# EAGLE design AC Motor Control Shield (EAGLE 6.4)
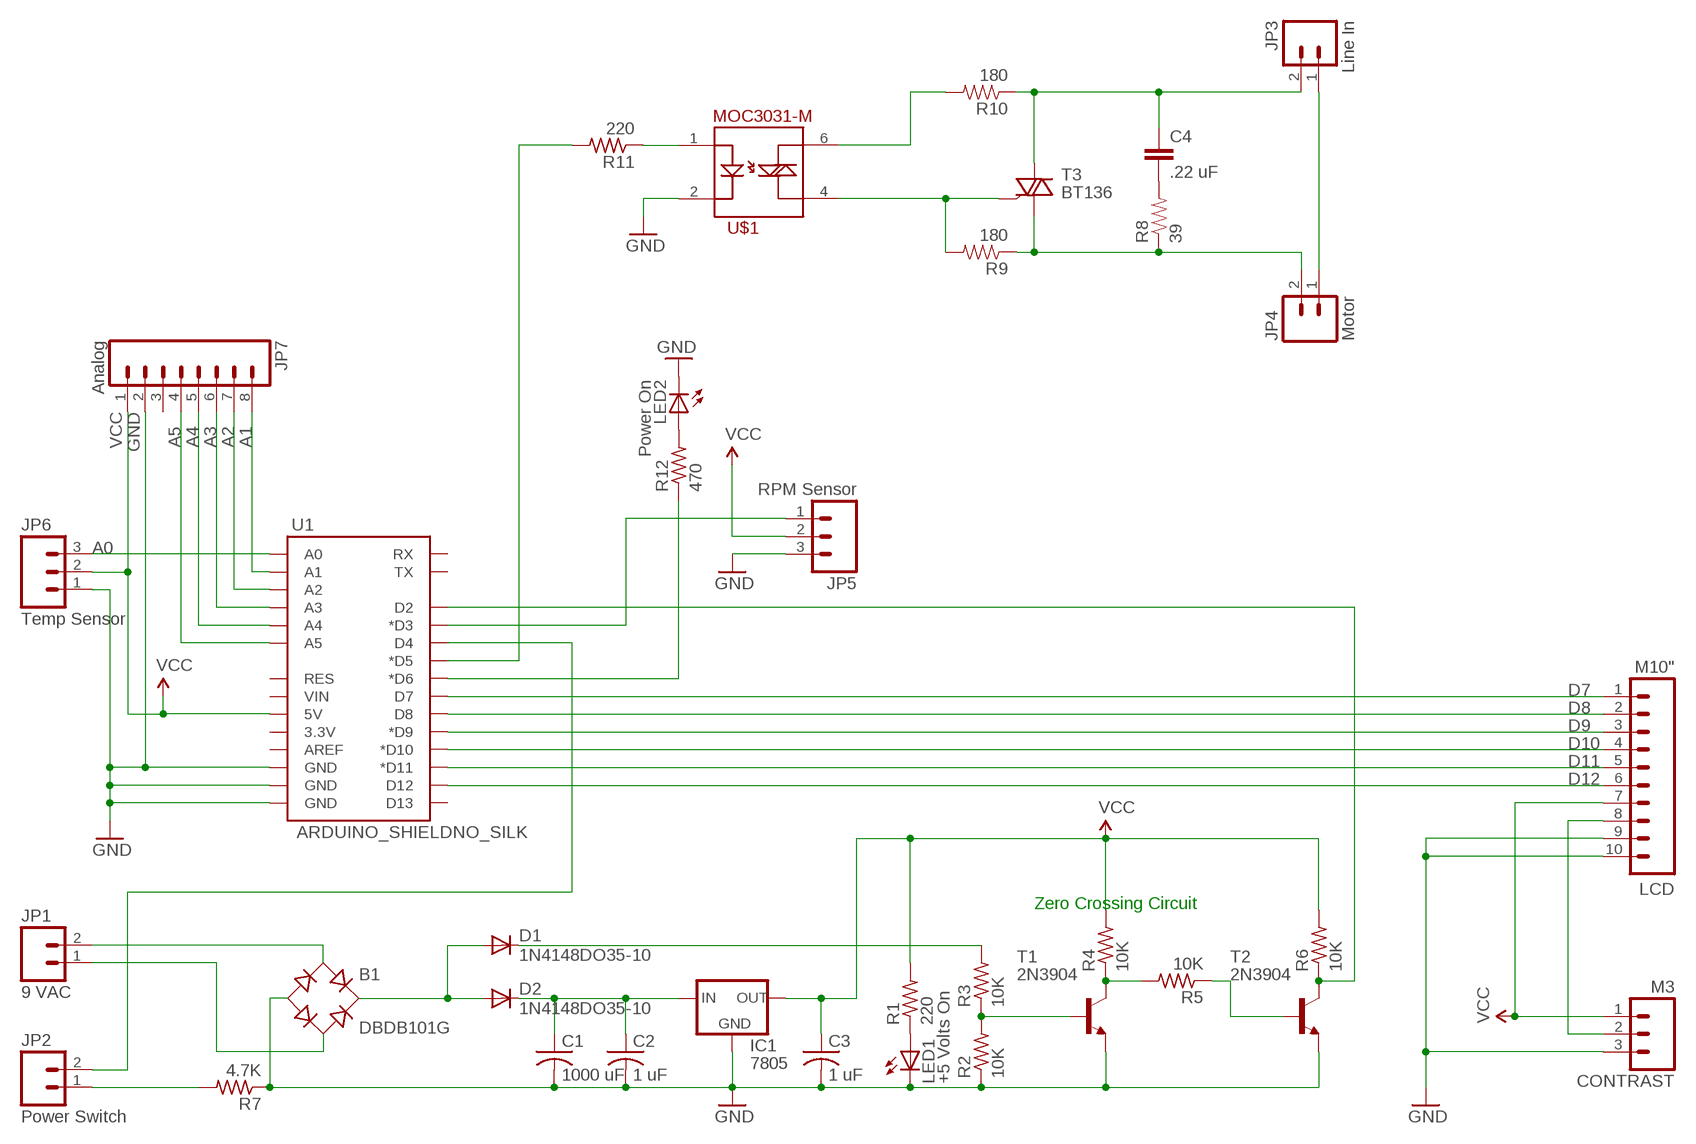
[diagram p0: schematic, sheet 1]

## Parts
B1  DBDB101G  [DB]
C1  1000 uF  C-US050-035X075  [C050-035X075]
C2  1 uF  C-US050-035X075  [C050-035X075]
C3  1 uF  C-US050-035X075  [C050-035X075]
C4  .22 uF  CAPPTH3  [CAP-PTH-LARGE]
CONTRAST  M3  M03PTH  [1X03]
D1  1N4148DO35-10  [DO35-10]
D2  1N4148DO35-10  [DO35-10]
IC1  7805  V_REG_78XX-TO-220  [TO-220-ALT]
JP1  9 VAC  M025MM  [SCREWTERMINAL-5MM-2]
JP2  Power Switch  M02PTH  [1X02]
JP3  Line In  M025MM  [SCREWTERMINAL-5MM-2]
JP4  Motor  M025MM  [SCREWTERMINAL-5MM-2]
JP5  RPM Sensor  M03PTH  [1X03]
JP6  Temp Sensor  M03PTH  [1X03]
JP7  Analog  M081X08  [1X08]
LCD  M10"  [1X10]
LED1  +5 Volts On  LED5MM  [LED5MM]
LED2  Power On  LED5MM  [LED5MM]
R1  220  R-US_0207/10  [0207/10]
R2  10K  R-US_0207/10  [0207/10]
R3  10K  R-US_0207/10  [0207/10]
R4  10K  R-US_0207/10  [0207/10]
R5  10K  R-US_0207/10  [0207/10]
R6  10K  R-US_0207/10  [0207/10]
R7  4.7K  R-US_0207/10  [0207/10]
R8  39  RESISTORPTH-1W  [AXIAL-0.6]
R9  180  RESISTORPTH-1W  [AXIAL-0.6]
R10  180  RESISTORPTH-1W  [AXIAL-0.6]
R11  220  R-US_0207/10  [0207/10]
R12  470  R-US_0207/10  [0207/10]
T1  2N3904  [TO92]
T2  2N3904  [TO92]
T3  BT136  [TO220AB]
U1  ARDUINO_SHIELDNO_SILK  [DUEMILANOVE_VIAS]
U$1  MOC3031-M  [DIL06]

## Nets
A0: JP6.3 U1.A0
A1: JP7.8 U1.A1
A2: JP7.7 U1.A2
A3: JP7.6 U1.A3
A4: JP7.5 U1.A4
A5: JP7.4 U1.A5
D7: LCD.1 U1.D7
D8: LCD.2 U1.D8
D9: LCD.3 U1.D9(*D9)
D10: LCD.4 U1.D10(*D10)
D11: LCD.5 U1.D11(*D11)
D12: LCD.6 U1.D12
GND: B1.- C1.2 C2.2 C3.2 CONTRAST.3 IC1.GND JP5.3 JP6.1 JP7.2 LCD.9 LCD.10 LED1.K(C) LED2.K(C) R2.1 R7.1 T1.3(E) T2.3(E) U1.GND@0(GND) U1.GND@1(GND) U1.GND@2(GND) U$1.2
N$1: B1.AC2 JP1.1
N$2: B1.AC1 JP1.2
N$3: R5.1 T2.2(B)
N$4: B1.+ D1.A D2.A
N$5: D1.C R3.2
N$6: C1.1 C2.1 D2.C IC1.IN
N$7: JP2.1 R7.2
N$8: LED1.A R1.1
N$9: R2.2 R3.1 T1.2(B)
N$10: R4.1 R5.2 T1.1(C)
N$11: R6.1 T2.1(C) U1.D2
N$12: JP2.2 U1.D4
N$13: JP3.1 JP4.1
N$14: C4.2 R8.P$2
N$15: C4.1 JP3.2 R10.P$1 T3.2(A2)
N$17: JP4.2 R8.P$1 R9.P$1 T3.1(A1)
N$18: R9.P$2 T3.3(G) U$1.4
N$19: R10.P$2 U$1.6
N$21: R11.1 U$1.1
N$22: R11.2 U1.D5(*D5)
N$24: JP5.1 U1.D3(*D3)
N$36: CONTRAST.2 LCD.8
N$37: LED2.A R12.2
N$38: R12.1 U1.D6(*D6)
VCC: C3.1 CONTRAST.1 IC1.OUT JP5.2 JP6.2 JP7.1 LCD.7 R1.2 R4.2 R6.2 U1.5V
Unconnected: JP7.3 U1.3.3V U1.AREF U1.D13 U1.RES U1.RX U1.TX U1.VIN

## Notes on the sheet
- Zero Crossing Circuit

## Library data of the parts
B1 = rectifier:DB?*G: Single Phase 1.0 AMP Glass Passivated Bridge Rectifier Taiwan Semiconductor Co.,Ltd. - TSC Source: http://www.taiwansemi.com/TSCbig5/ezcatfiles/cust/img/img/db101g.pdf http://www.ts.com.tw/db/pictures/modules/PDT/PDT060207001/DBLS201G.pdf
C1-C3 = rcl:C-US: CAPACITOR, American symbol
C4 = SparkFun-Capacitors:CAP: Capacitor Standard 0603 ceramic capacitor, and 0.1" leaded capacitor.
CONTRAST JP5 JP6 = SparkFun-Connectors:M03: Header 3 Standard 3-pin 0.1" header. Use with straight break away headers (SKU : PRT-00116), right angle break away headers (PRT-00553), swiss pins (PRT-00743), machine pins (PRT-00117), and female headers (PRT-00115). Molex polarized connector foot print use with SKU : PRT-08232 with associated crimp pins and housings.
D1 D2 = diode:1N4148: DIODE high speed (Philips)
IC1 = SparkFun-PowerIC:V_REG_78XX: Voltage Regulator Standard 7805 5V regulator. IGO (Input Ground Output). Spark Fun Electronics SKU : COM-00107
JP1-JP4 = SparkFun-Connectors:M02: Header 2 Standard 2-pin 0.1" header. Use with straight break away headers (SKU : PRT-00116), right angle break away headers (PRT-00553), swiss pins (PRT-00743), machine pins (PRT-00117), and female headers (PRT-00115). Molex polarized connector foot print use with SKU : PRT-08233 with associated crimp pins and housings.
JP7 = SparkFun-Connectors:M08: Header 8 Standard 8-pin 0.1" header. Use with straight break away headers (SKU : PRT-00116), right angle break away headers (PRT-00553), swiss pins (PRT-00743), machine pins (PRT-00117), and female headers (PRT-00115).
LCD = SparkFun-Connectors:M10: Header 10 Standard 10-pin 0.1" header. Use with straight break away headers (SKU : PRT-00116), right angle break away headers (PRT-00553), swiss pins (PRT-00743), machine pins (PRT-00117), and female headers (PRT-00115).
LED1 LED2 = led:LED: LED OSRAM: - CHIPLED LG R971, LG N971, LY N971, LG Q971, LY Q971, LO R971, LY R971 LH N974, LH R974 LS Q976, LO Q976, LY Q976 LO Q996 - Hyper CHIPLED LW Q18S LB Q993, LB Q99A, LB R99A - SideLED LS A670, LO A670, LY A670, LG A670, LP A670 LB A673, LV A673, LT A673, LW A673 LH A674 LY A675 LS A676, LA A676, LO A676, LY A676, LW A676 LS A679, LY A679, LG A679 - Hyper Micro SIDELED® LS Y876, LA Y876, LO Y876, LY Y876 LT Y87S - SmartLED LW L88C, LW L88S LB L89C, LB L89S, LG L890 LS L89K, LO L89K, LY L89K LS L896, LA L896, LO L896, LY L896 - TOPLED LS T670, LO T670, LY T670, LG T670, LP T670 LSG T670, LSP T670, LSY T670, LOP T670, LYG T670 LG T671, LOG T671, LSG T671 LB T673, LV T673, LT T673, LW T673 LH T674 LS T676, LA T676, LO T676, LY T676, LB T676, LH T676, LSB T676, LW T676 LB T67C, LV T67C, LT T67C, LS T67K, LO T67K, LY T67K, LW E67C LS E67B, LA E67B, LO E67B, LY E67B, LB E67C, LV E67C, LT E67C LW T67C LS T679, LY T679, LG T679 LS T770, LO T770, LY T770, LG T770, LP T770 LB T773, LV T773, LT T773, LW T773 LH T774 LS E675, LA E675, LY E675, LS T675 LS T776, LA T776, LO T776, LY T776, LB T776 LHGB T686 LT T68C, LB T68C - Hyper Mini TOPLED® LB M676 - Mini TOPLED Santana® LG M470 LS M47K, LO M47K, LY M47K Source: http://www.osram.convergy.de LUXEON: - LUMILED® LXK2-PW12-R00, LXK2-PW12-S00, LXK2-PW14-U00, LXK2-PW14-V00 LXK2-PM12-R00, LXK2-PM12-S00, LXK2-PM14-U00 LXK2-PE12-Q00, LXK2-PE12-R00, LXK2-PE12-S00, LXK2-PE14-T00, LXK2-PE14-U00 LXK2-PB12-K00, LXK2-PB12-L00, LXK2-PB12-M00, LXK2-PB14-N00, LXK2-PB14-P00, LXK2-PB14-Q00 LXK2-PR12-L00, LXK2-PR12-M00, LXK2-PR14-Q00, LXK2-PR14-R00 LXK2-PD12-Q00, LXK2-PD12-R00, LXK2-PD12-S00 LXK2-PH12-R00, LXK2-PH12-S00 LXK2-PL12-P00, LXK2-PL12-Q00, LXK2-PL12-R00 Source: www.luxeon.com KINGBRIGHT: KA-3528ASYC Source: www.kingbright.com
R1-R7 R11 R12 = resistor:R-US_: RESISTOR, American symbol
R8-R10 = SparkFun-Resistors:RESISTOR: Resistor Basic schematic elements and footprints for 0603, 1206, and PTH resistors.
T1 T2 = transistor:2N3904: NPN TRANSISTOR
T3 = triac:BT136: Triac BT136 series E sensitive gate Source: http://www.nxp.com/acrobat_download/datasheets/BT136_SERIES_E_2.pdf
U1 = SparkFun-Boards:ARDUINO_SHIELD: Arduino shield footprint
U$1 = SparkFun-DiscreteSemi:MOC3031-M: Opto-isolated TRIAC

## Board
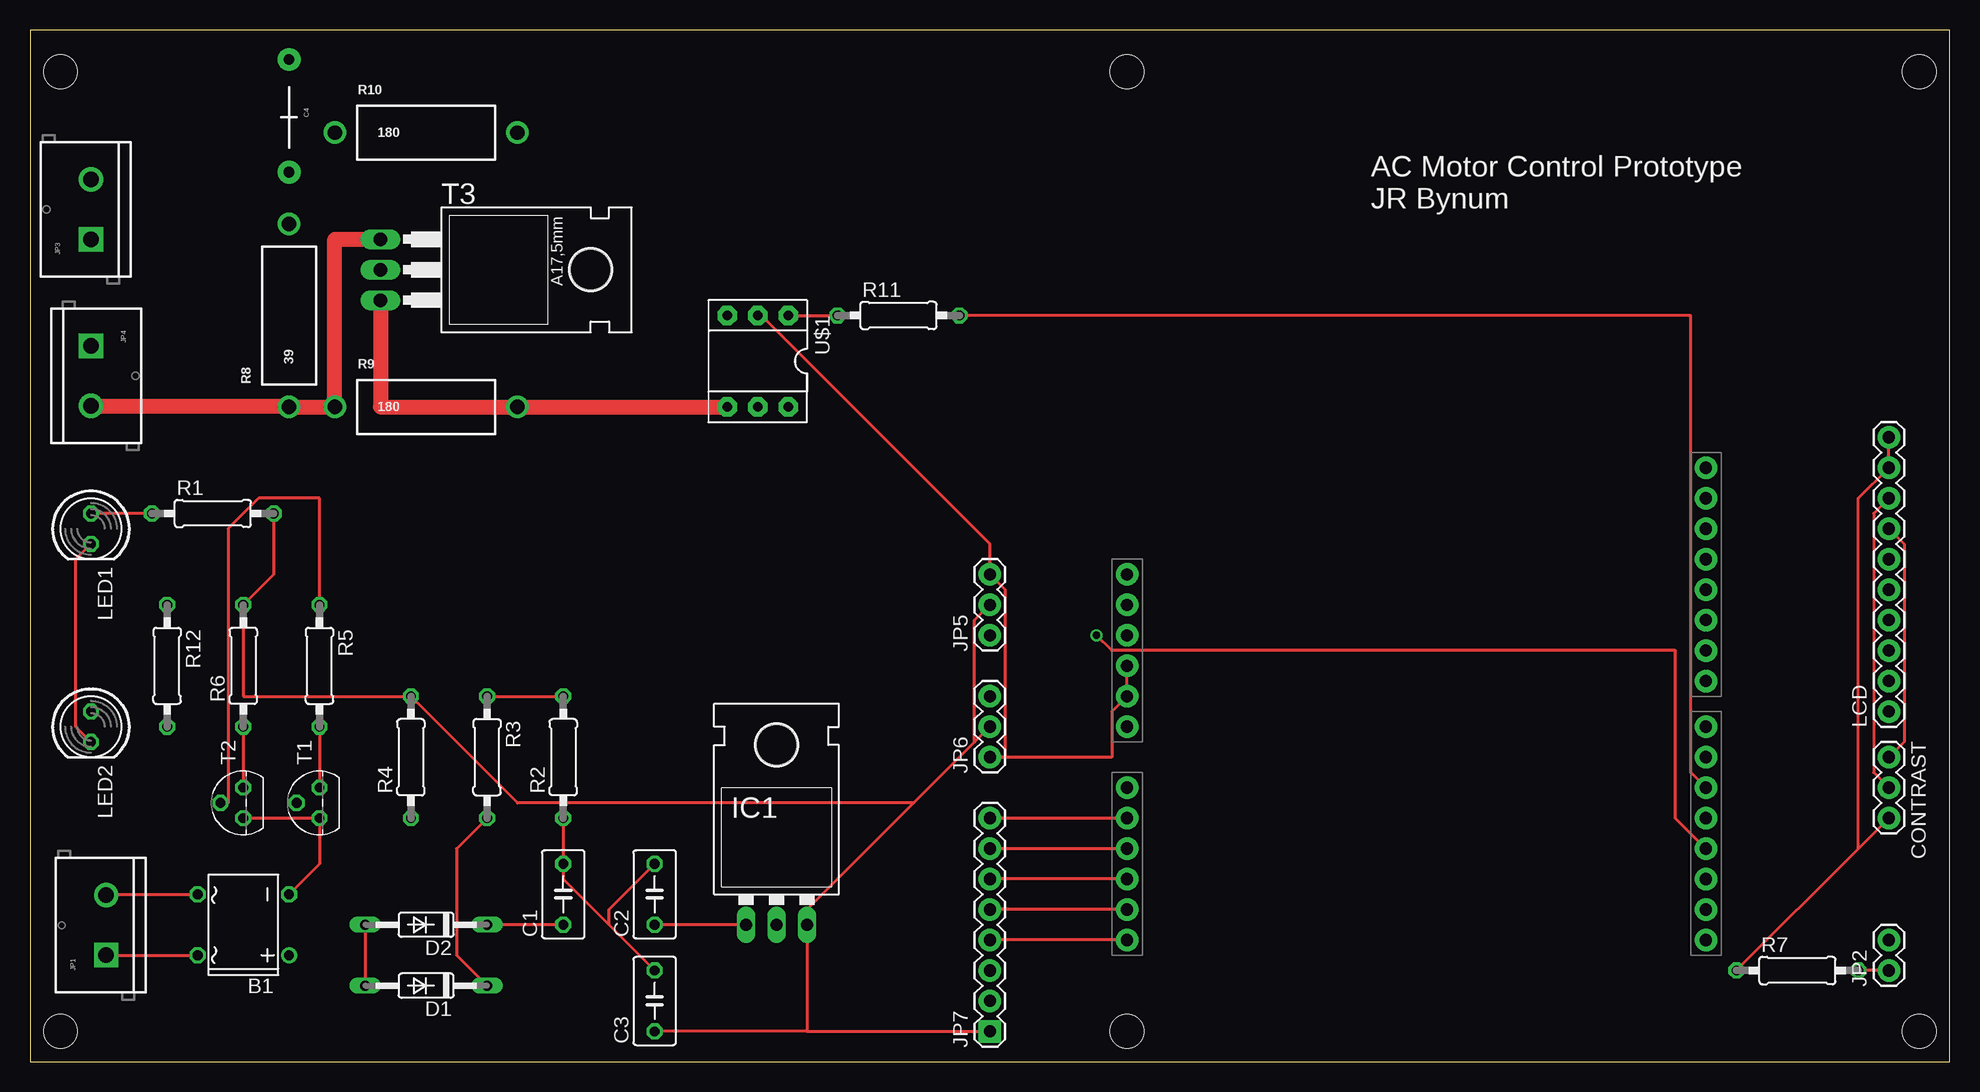
[diagram p1: board, top side]
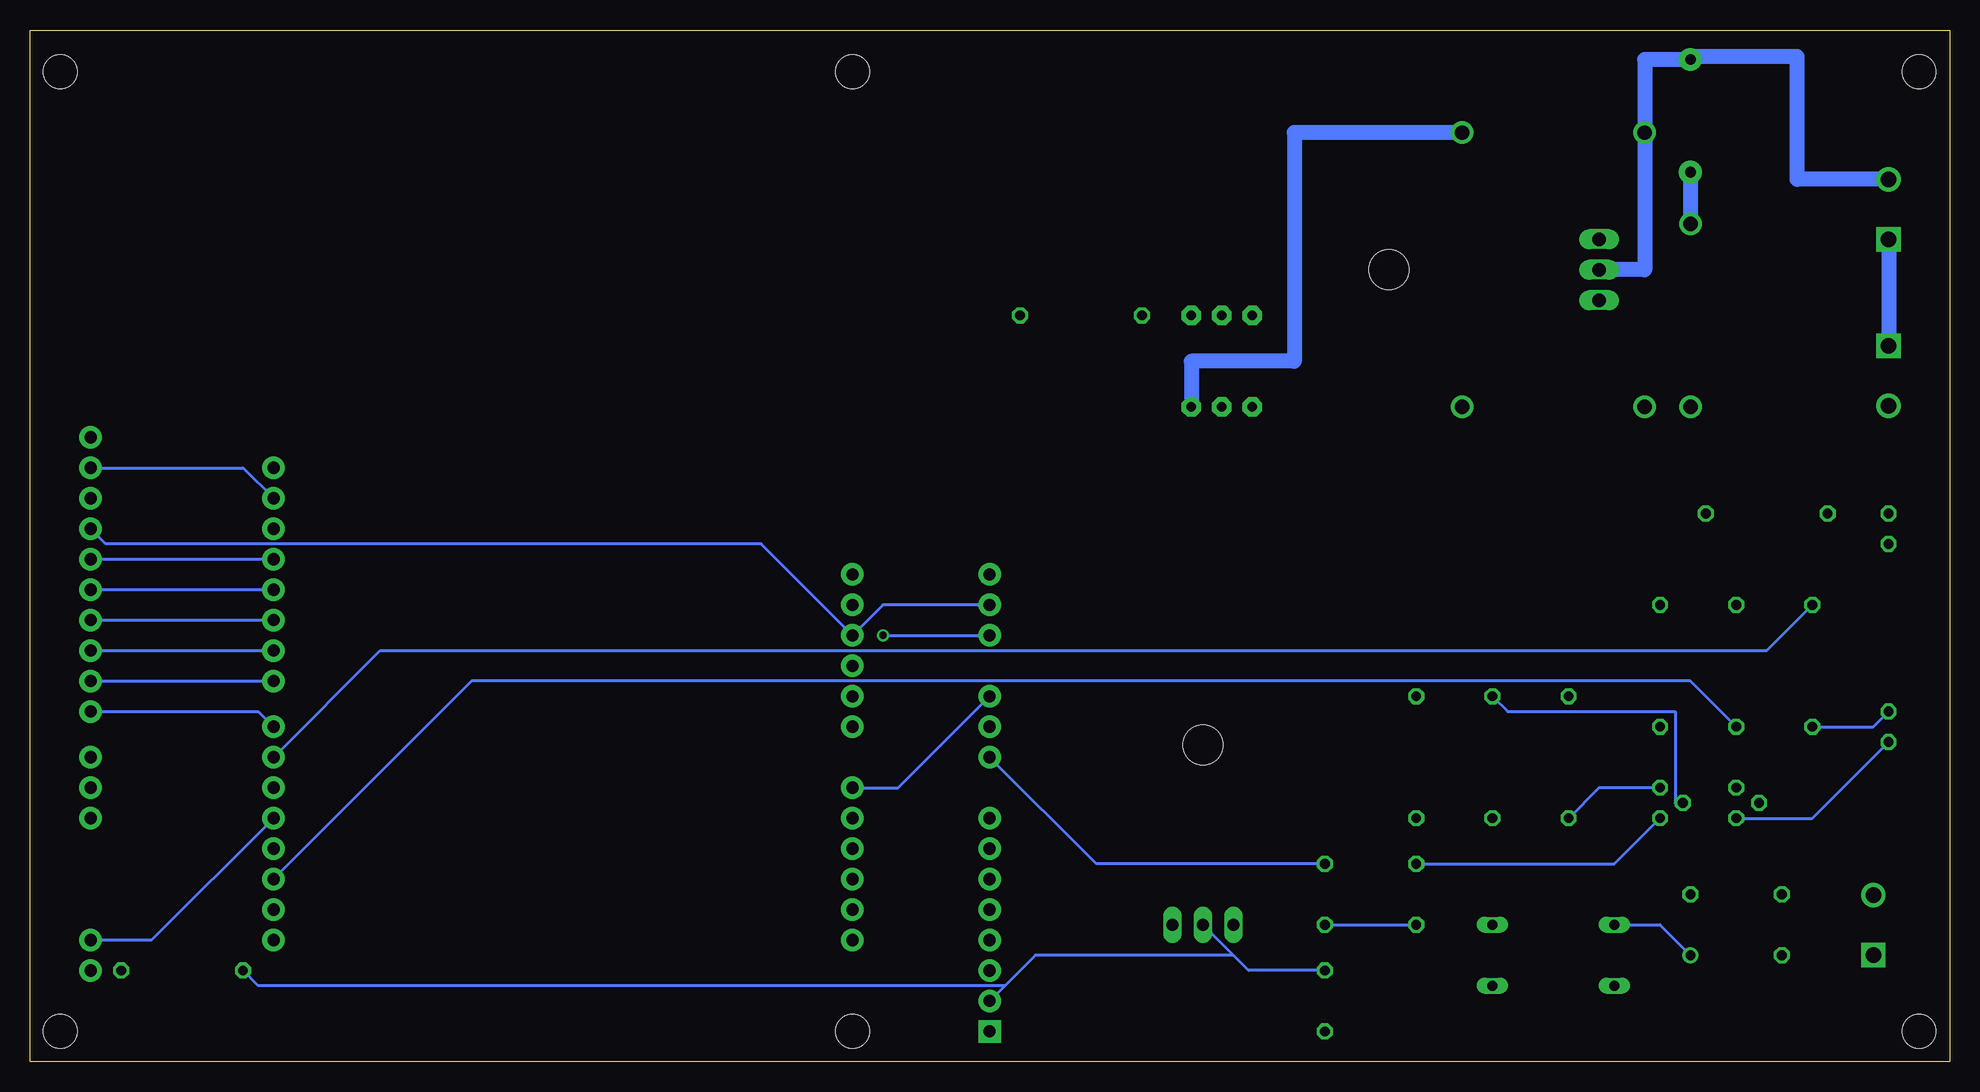
[diagram p2: board, bottom side, seen from below]

Size 160 x 86.03 mm. Coordinates in mm from the lower left corner, seen from the top.
Outline: 0,0 160,0 160,86.03 0,86.03 0,0
Copper layers (1*16): Top 0.035mm / dielectric 1.5mm / Bottom 0.035mm
Design rules "default": minimum track width 10mil, minimum drill 24mil, track to track 8mil, track to pad 8mil, pad to pad 8mil, via to via 8mil, smd to smd 8mil, copper to edge 40mil, drill to drill 8mil, minimum pad ring 10mil, minimum via ring 8mil, stop-mask expansion 4mil, vias tented up to drill 0mil, thermal gap 10mil
Holes 2.8 mm at 157.48,82.55 2.54,82.55 157.48,2.54 2.54,2.54 91.44,2.54 91.44,82.55

### Footprints (pad centres in the part's own frame; a part is rotated, then mirrored left to right if it is on the bottom)
DB = drill 0.813: + -2.54,-3.81 | drill 0.813 octagon: - 2.54,-3.81; AC1 2.54,3.81; AC2 -2.54,3.81
C050-035X075 = drill 0.813 octagon: 1 -2.54,0; 2 2.54,0
CAP-PTH-LARGE = drill 0.9 pad 1.905: 1 -4.826,0; 2 4.572,0
1X03 = drill 1.016 pad 1.88: 1 0,0; 2 2.54,0; 3 5.08,0
DO35-10 = drill 0.813 long: A 5.08,0; C -5.08,0
TO-220-ALT = drill 1.016 long: GND 0,-3.81; IN -2.54,-3.81; OUT 2.54,-3.81 | hole 3.302: 0,11.176
SCREWTERMINAL-5MM-2 = drill 1.3 pad 2.032 square: 1 0,0 | drill 1.3 pad 2.032: 2 5,0
1X02 = drill 1.016 pad 1.88: 1 0,0; 2 2.54,0
1X08 = drill 1.016 pad 1.88 square: 1 0,0 | drill 1.016 pad 1.88: 2 2.54,0; 3 5.08,0; 4 7.62,0; 5 10.16,0; 6 12.7,0; 7 15.24,0; 8 17.78,0
1X10 = drill 1.016 pad 1.88: 1 0,0; 2 2.54,0; 3 5.08,0; 4 7.62,0; 5 10.16,0; 6 12.7,0; 7 15.24,0; 8 17.78,0; 9 20.32,0; 10 22.86,0
LED5MM = drill 0.813 octagon: A -1.27,0; K 1.27,0
0207/10 = drill 0.813 octagon: 1 -5.08,0; 2 5.08,0
AXIAL-0.6 = drill 1.2 pad 1.88: P$1 -7.62,0; P$2 7.62,0
TO92 = drill 0.813 octagon: 1 1.27,0; 2 0,1.905; 3 -1.27,0
TO220AB = drill 1.118 long: 1 -2.54,-6.35; 2 0,-6.35; 3 2.54,-6.35 | hole 3.302: 0,11.176
DUEMILANOVE_VIAS = drill 1.016 pad 1.88: 3.3V 50.8,13.97; 5V 50.8,16.51; A0 50.8,29.21; A1 50.8,31.75; A2 50.8,34.29; A3 50.8,36.83; A4 50.8,39.37; A5 50.8,41.91; AREF 2.54,2.54; D2 2.54,36.83; D3 2.54,34.29; D4 2.54,31.75; D5 2.54,29.21; D6 2.54,26.67; D7 2.54,24.13; D8 2.54,20.32; D9 2.54,17.78; D10 2.54,15.24; D11 2.54,12.7; D12 2.54,10.16; D13 2.54,7.62; GND@0 50.8,19.05; GND@1 50.8,21.59; GND@2 2.54,5.08; RES 50.8,11.43; RX 2.54,41.91; TX 2.54,39.37; VIN 50.8,24.13
DIL06 = drill 0.813 pad 1.6 octagon: 1 -3.51,-3.81; 2 -0.97,-3.81; 3 1.57,-3.81; 4 1.57,3.81; 5 -0.97,3.81; 6 -3.51,3.81

### Placement (x,y rotation side)
B1  17.78,11.43 90 top
C1  44.45,13.97 90 top
C2  52.07,13.97 90 top
C3  52.07,5.08 90 top
C4  21.59,78.74 270 top
CONTRAST  154.94,25.4 270 top
D1  33.02,6.35 180 top
D2  33.02,11.43 180 top
IC1  62.23,15.24 0 top
JP1  6.35,8.89 90 top
JP2  154.94,7.62 90 top
JP3  5.08,68.58 90 top
JP4  5.08,59.69 270 top
JP5  80.01,35.56 90 top
JP6  80.01,25.4 90 top
JP7  80.01,2.54 90 top
LCD  154.94,29.21 90 top
LED1  5.08,44.45 270 top
LED2  5.08,27.94 270 top
R1  15.24,45.72 0 top
R2  44.45,25.4 90 top
R3  38.1,25.4 270 top
R4  31.75,25.4 90 top
R5  24.13,33.02 270 top
R6  17.78,33.02 90 top
R7  147.32,7.62 0 top
R8  21.59,62.23 90 top
R9  33.02,54.61 0 top
R10  33.02,77.47 0 top
R11  72.39,62.23 0 top
R12  11.43,33.02 270 top
T1  24.13,21.59 90 top
T2  17.78,21.59 90 top
T3  35.56,66.04 270 top
U1  142.24,52.07 180 top
U$1  59.69,58.42 180 top

### Tracks (layer width: path | path; a pad name or v marks a point on that pad's centre or on a via)
A0
  Bottom 0.254: JP6.3 87.63,22.86 U1.A0
A1
  Top 0.254: U1.A1 JP7.8
A2
  Top 0.254: U1.A2 JP7.7
A3
  Top 0.254: U1.A3 JP7.6
A4
  Top 0.254: U1.A4 JP7.5
A5
  Top 0.254: U1.A5 JP7.4
D7
  Bottom 0.254: U1.D7 140.97,29.21 LCD.1
D8
  Bottom 0.254: LCD.2 U1.D8
D9
  Bottom 0.254: LCD.3 U1.D9
D10
  Bottom 0.254: LCD.4 U1.D10
D11
  Bottom 0.254: LCD.5 U1.D11
D12
  Bottom 0.254: LCD.6 U1.D12
GND
  Top 0.254: 81.28,25.4 90.17,25.4 90.17,29.21 U1.GND@1 U1.GND@0 | 81.28,25.4 JP6.1 | U$1.2 60.96,62.23 80.01,43.18 JP5.3 81.28,39.37 81.28,25.4 | LCD.10 LCD.9 152.4,46.99 152.4,17.78 | CONTRAST.3 152.4,17.78 | 152.4,17.78 R7.1 | B1.- 24.13,16.51 T1.3 T2.3 | LED1.K 3.81,41.91 3.81,27.94 LED2.K | R2.1 C1.2 44.45,15.24 48.26,11.43 | 48.26,11.43 C3.2 | C2.2 48.26,12.7 48.26,11.43
  Bottom 0.254: U1.GND@2 142.24,49.53 LCD.9 | LED2.K 11.43,20.32 T2.3 | 59.69,8.89 58.42,7.62 C3.2 | 59.69,8.89 IC1.GND | 78.74,6.35 76.2,8.89 59.69,8.89 | 78.74,6.35 JP7.2 | T1.3 27.94,16.51 C1.2 | R7.1 140.97,6.35 78.74,6.35 | JP6.1 71.12,16.51 C2.2
N$1
  Top 0.254: JP1.1 B1.AC2
N$2
  Top 0.254: B1.AC1 6.35,13.97 JP1.2
N$3
  Top 0.254: R5.1 24.13,46.99 19.05,46.99 16.51,44.45 16.51,21.59 T2.2
N$4
  Top 0.254: D2.A D1.A
  Bottom 0.254: B1.+ 24.13,11.43 D2.A
N$5
  Top 0.254: D1.C 35.56,8.89 35.56,17.78 R3.2
N$6
  Top 0.254: C1.1 D2.C | IC1.IN C2.1
  Bottom 0.254: C2.1 C1.1
N$7
  Top 0.254: JP2.1 R7.2
N$8
  Top 0.254: R1.1 LED1.A
N$9
  Top 0.254: R3.1 R2.2
  Bottom 0.254: R3.1 36.83,29.21 22.86,29.21 22.86,21.59 T1.2
N$10
  Top 0.254: R5.2 T1.1
  Bottom 0.254: R4.1 29.21,22.86 T1.1
N$11
  Top 0.254: R6.1 T2.1
  Bottom 0.254: U1.D2 123.19,31.75 21.59,31.75 R6.1
N$12
  Bottom 0.254: U1.D4 149.86,10.16 JP2.2
N$13
  Bottom 1.27: JP3.1 JP4.1
N$14
  Bottom 1.27: C4.2 R8.P$2
N$15
  Bottom 1.27: 25.4,77.43 R10.P$1 | R10.P$1 25.4,66.04 T3.2 | JP3.2 12.7,73.58 12.7,83.82 21.59,83.82 C4.1 25.4,83.57 R10.P$1
N$17
  Top 1.27: JP4.2 21.59,54.69 R8.P$1 R9.P$1 25.4,68.58 T3.1
N$18
  Top 1.27: T3.3 29.21,54.61 R9.P$2 U$1.4
N$19
  Bottom 1.27: R10.P$2 54.61,77.47 54.61,58.42 63.2,58.42 U$1.6
N$21
  Top 0.254: U$1.1 R11.1
N$22
  Top 0.254: R11.2 138.43,62.23 138.43,24.13 U1.D5
N$24  (via drill 0.61)
  Top 0.254: v88.9,35.56 90.17,34.29 137.16,34.29 137.16,20.32 U1.D3
  Bottom 0.254: v88.9,35.56 JP5.1
N$36
  Top 0.254: CONTRAST.2 153.67,24.13 153.67,45.72 LCD.8
N$37
  Bottom 0.254: LED2.A 6.35,27.94 R12.2
N$38
  Bottom 0.254: R12.1 15.24,34.29 130.81,34.29 U1.D6
VCC
  Top 0.254: R1.2 20.32,40.64 R6.2 17.78,30.48 R4.2 40.64,21.59 73.66,21.59 | CONTRAST.1 156.21,26.67 156.21,43.18 LCD.7 | 64.77,2.54 C3.1 | 64.77,2.54 IC1.OUT 64.77,12.7 73.66,21.59 | 64.77,2.54 JP7.1 | 73.66,21.59 78.74,26.67 | 78.74,26.67 JP6.2 | JP5.2 78.74,36.83 78.74,26.67
  Bottom 0.254: JP5.2 88.9,38.1 U1.5V 99.06,43.18 153.67,43.18 LCD.7

### Text on the board
tNames: AC Motor Control Prototype / JR Bynum